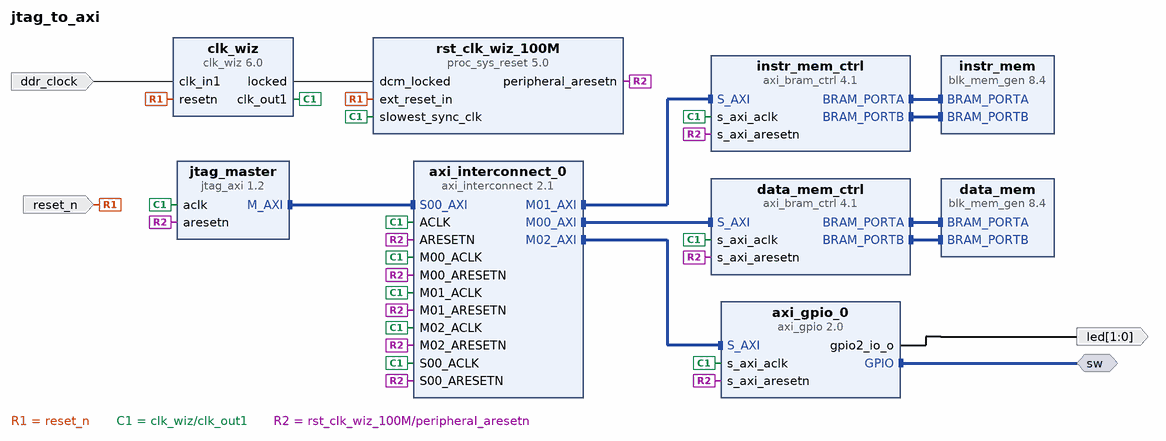
[diagram p0: block diagram of the top level]
# Vivado block design jtag_to_axi, xc7s50csga324-1, Vivado 2020.1
create_bd_design jtag_to_axi

create_bd_intf_port -mode Master -vlnv xilinx.com:interface:gpio_rtl:1.0 sw
create_bd_port -dir I -type clk ddr_clock
set_property -dict {CONFIG.FREQ_HZ 100000000} [get_bd_ports ddr_clock]
create_bd_port -dir I -type rst reset_n
set_property -dict {CONFIG.POLARITY ACTIVE_LOW} [get_bd_ports reset_n]
create_bd_port -dir O -from 1 -to 0 led

create_bd_cell -type ip -vlnv xilinx.com:ip:axi_bram_ctrl:4.1 data_mem_ctrl
create_bd_cell -type ip -vlnv xilinx.com:ip:axi_bram_ctrl:4.1 instr_mem_ctrl
create_bd_cell -type ip -vlnv xilinx.com:ip:proc_sys_reset:5.0 rst_clk_wiz_100M
create_bd_cell -type ip -vlnv xilinx.com:ip:axi_gpio:2.0 axi_gpio_0
set_property -dict [list \
  CONFIG.C_ALL_OUTPUTS_2 1 \
  CONFIG.C_GPIO2_WIDTH 2 \
  CONFIG.C_IS_DUAL 1 \
  CONFIG.GPIO_BOARD_INTERFACE dip_switches_4bits \
  CONFIG.USE_BOARD_FLOW true \
] [get_bd_cells axi_gpio_0]
create_bd_cell -type ip -vlnv xilinx.com:ip:axi_interconnect:2.1 axi_interconnect_0
set_property -dict {CONFIG.ENABLE_ADVANCED_OPTIONS 1 CONFIG.NUM_MI 3 CONFIG.NUM_SI 1} [get_bd_cells axi_interconnect_0]
create_bd_cell -type ip -vlnv xilinx.com:ip:clk_wiz:6.0 clk_wiz
set_property -dict [list \
  CONFIG.CLKOUT1_JITTER 226.435 \
  CONFIG.CLKOUT1_PHASE_ERROR 236.795 \
  CONFIG.CLKOUT1_REQUESTED_OUT_FREQ 75.000 \
  CONFIG.MMCM_CLKFBOUT_MULT_F 40.125 \
  CONFIG.MMCM_CLKOUT0_DIVIDE_F 13.375 \
  CONFIG.MMCM_DIVCLK_DIVIDE 4 \
  CONFIG.RESET_PORT resetn \
  CONFIG.RESET_TYPE ACTIVE_LOW \
] [get_bd_cells clk_wiz]
create_bd_cell -type ip -vlnv xilinx.com:ip:blk_mem_gen:8.4 data_mem
set_property -dict [list \
  CONFIG.Assume_Synchronous_Clk true \
  CONFIG.Enable_B Use_ENB_Pin \
  CONFIG.Memory_Type True_Dual_Port_RAM \
  CONFIG.Port_A_Write_Rate 50 \
  CONFIG.Port_B_Clock 100 \
  CONFIG.Port_B_Enable_Rate 100 \
  CONFIG.Port_B_Write_Rate 50 \
  CONFIG.Use_RSTB_Pin true \
] [get_bd_cells data_mem]
create_bd_cell -type ip -vlnv xilinx.com:ip:blk_mem_gen:8.4 instr_mem
set_property -dict [list \
  CONFIG.Assume_Synchronous_Clk true \
  CONFIG.Enable_B Use_ENB_Pin \
  CONFIG.Memory_Type True_Dual_Port_RAM \
  CONFIG.Port_A_Write_Rate 50 \
  CONFIG.Port_B_Clock 100 \
  CONFIG.Port_B_Enable_Rate 100 \
  CONFIG.Port_B_Write_Rate 50 \
  CONFIG.Use_RSTB_Pin true \
] [get_bd_cells instr_mem]
create_bd_cell -type ip -vlnv xilinx.com:ip:jtag_axi:1.2 jtag_master
set_property -dict {CONFIG.M_AXI_ID_WIDTH 4 CONFIG.RD_TXN_QUEUE_LENGTH 4 CONFIG.WR_TXN_QUEUE_LENGTH 4} [get_bd_cells jtag_master]

# ---- connections ----

connect_bd_intf_net [get_bd_intf_pins data_mem/BRAM_PORTA] [get_bd_intf_pins data_mem_ctrl/BRAM_PORTA]
connect_bd_intf_net [get_bd_intf_pins axi_interconnect_0/M00_AXI] [get_bd_intf_pins data_mem_ctrl/S_AXI]
connect_bd_intf_net [get_bd_intf_pins axi_interconnect_0/M02_AXI] [get_bd_intf_pins axi_gpio_0/S_AXI]
connect_bd_intf_net [get_bd_intf_pins instr_mem_ctrl/BRAM_PORTA] [get_bd_intf_pins instr_mem/BRAM_PORTA]
connect_bd_intf_net [get_bd_intf_pins jtag_master/M_AXI] [get_bd_intf_pins axi_interconnect_0/S00_AXI]
connect_bd_intf_net [get_bd_intf_pins axi_interconnect_0/M01_AXI] [get_bd_intf_pins instr_mem_ctrl/S_AXI]
connect_bd_intf_net [get_bd_intf_ports sw] [get_bd_intf_pins axi_gpio_0/GPIO]
connect_bd_intf_net [get_bd_intf_pins instr_mem/BRAM_PORTB] [get_bd_intf_pins instr_mem_ctrl/BRAM_PORTB]
connect_bd_intf_net [get_bd_intf_pins data_mem/BRAM_PORTB] [get_bd_intf_pins data_mem_ctrl/BRAM_PORTB]
connect_bd_net [get_bd_ports ddr_clock] [get_bd_pins clk_wiz/clk_in1]
connect_bd_net -net reset_1 [get_bd_ports reset_n] [get_bd_pins rst_clk_wiz_100M/ext_reset_in] [get_bd_pins clk_wiz/resetn]
connect_bd_net [get_bd_pins clk_wiz/clk_out1] \
  [get_bd_pins rst_clk_wiz_100M/slowest_sync_clk] [get_bd_pins data_mem_ctrl/s_axi_aclk] \
  [get_bd_pins instr_mem_ctrl/s_axi_aclk] [get_bd_pins axi_gpio_0/s_axi_aclk] [get_bd_pins axi_interconnect_0/ACLK] \
  [get_bd_pins axi_interconnect_0/S00_ACLK] [get_bd_pins axi_interconnect_0/M00_ACLK] \
  [get_bd_pins axi_interconnect_0/M01_ACLK] [get_bd_pins axi_interconnect_0/M02_ACLK] [get_bd_pins jtag_master/aclk]
connect_bd_net [get_bd_pins rst_clk_wiz_100M/peripheral_aresetn] \
  [get_bd_pins data_mem_ctrl/s_axi_aresetn] [get_bd_pins instr_mem_ctrl/s_axi_aresetn] [get_bd_pins axi_gpio_0/s_axi_aresetn] \
  [get_bd_pins axi_interconnect_0/ARESETN] [get_bd_pins axi_interconnect_0/S00_ARESETN] \
  [get_bd_pins axi_interconnect_0/M00_ARESETN] [get_bd_pins axi_interconnect_0/M01_ARESETN] \
  [get_bd_pins axi_interconnect_0/M02_ARESETN] [get_bd_pins jtag_master/aresetn]
connect_bd_net [get_bd_pins clk_wiz/locked] [get_bd_pins rst_clk_wiz_100M/dcm_locked]
connect_bd_net [get_bd_pins axi_gpio_0/gpio2_io_o] [get_bd_ports led]

# ---- address map ----
assign_bd_address -offset 0x00000000 -range 4K -target_address_space [get_bd_addr_spaces jtag_master/Data] [get_bd_addr_segs data_mem_ctrl/S_AXI/Mem0]
assign_bd_address -offset 0x00001000 -range 4K -target_address_space [get_bd_addr_spaces jtag_master/Data] [get_bd_addr_segs instr_mem_ctrl/S_AXI/Mem0]
assign_bd_address -offset 0x00002000 -range 4K -target_address_space [get_bd_addr_spaces jtag_master/Data] [get_bd_addr_segs axi_gpio_0/S_AXI/Reg]

validate_bd_design
save_bd_design
